# EAGLE design OSSI-1 Battery Board (EAGLE 6.5.0)
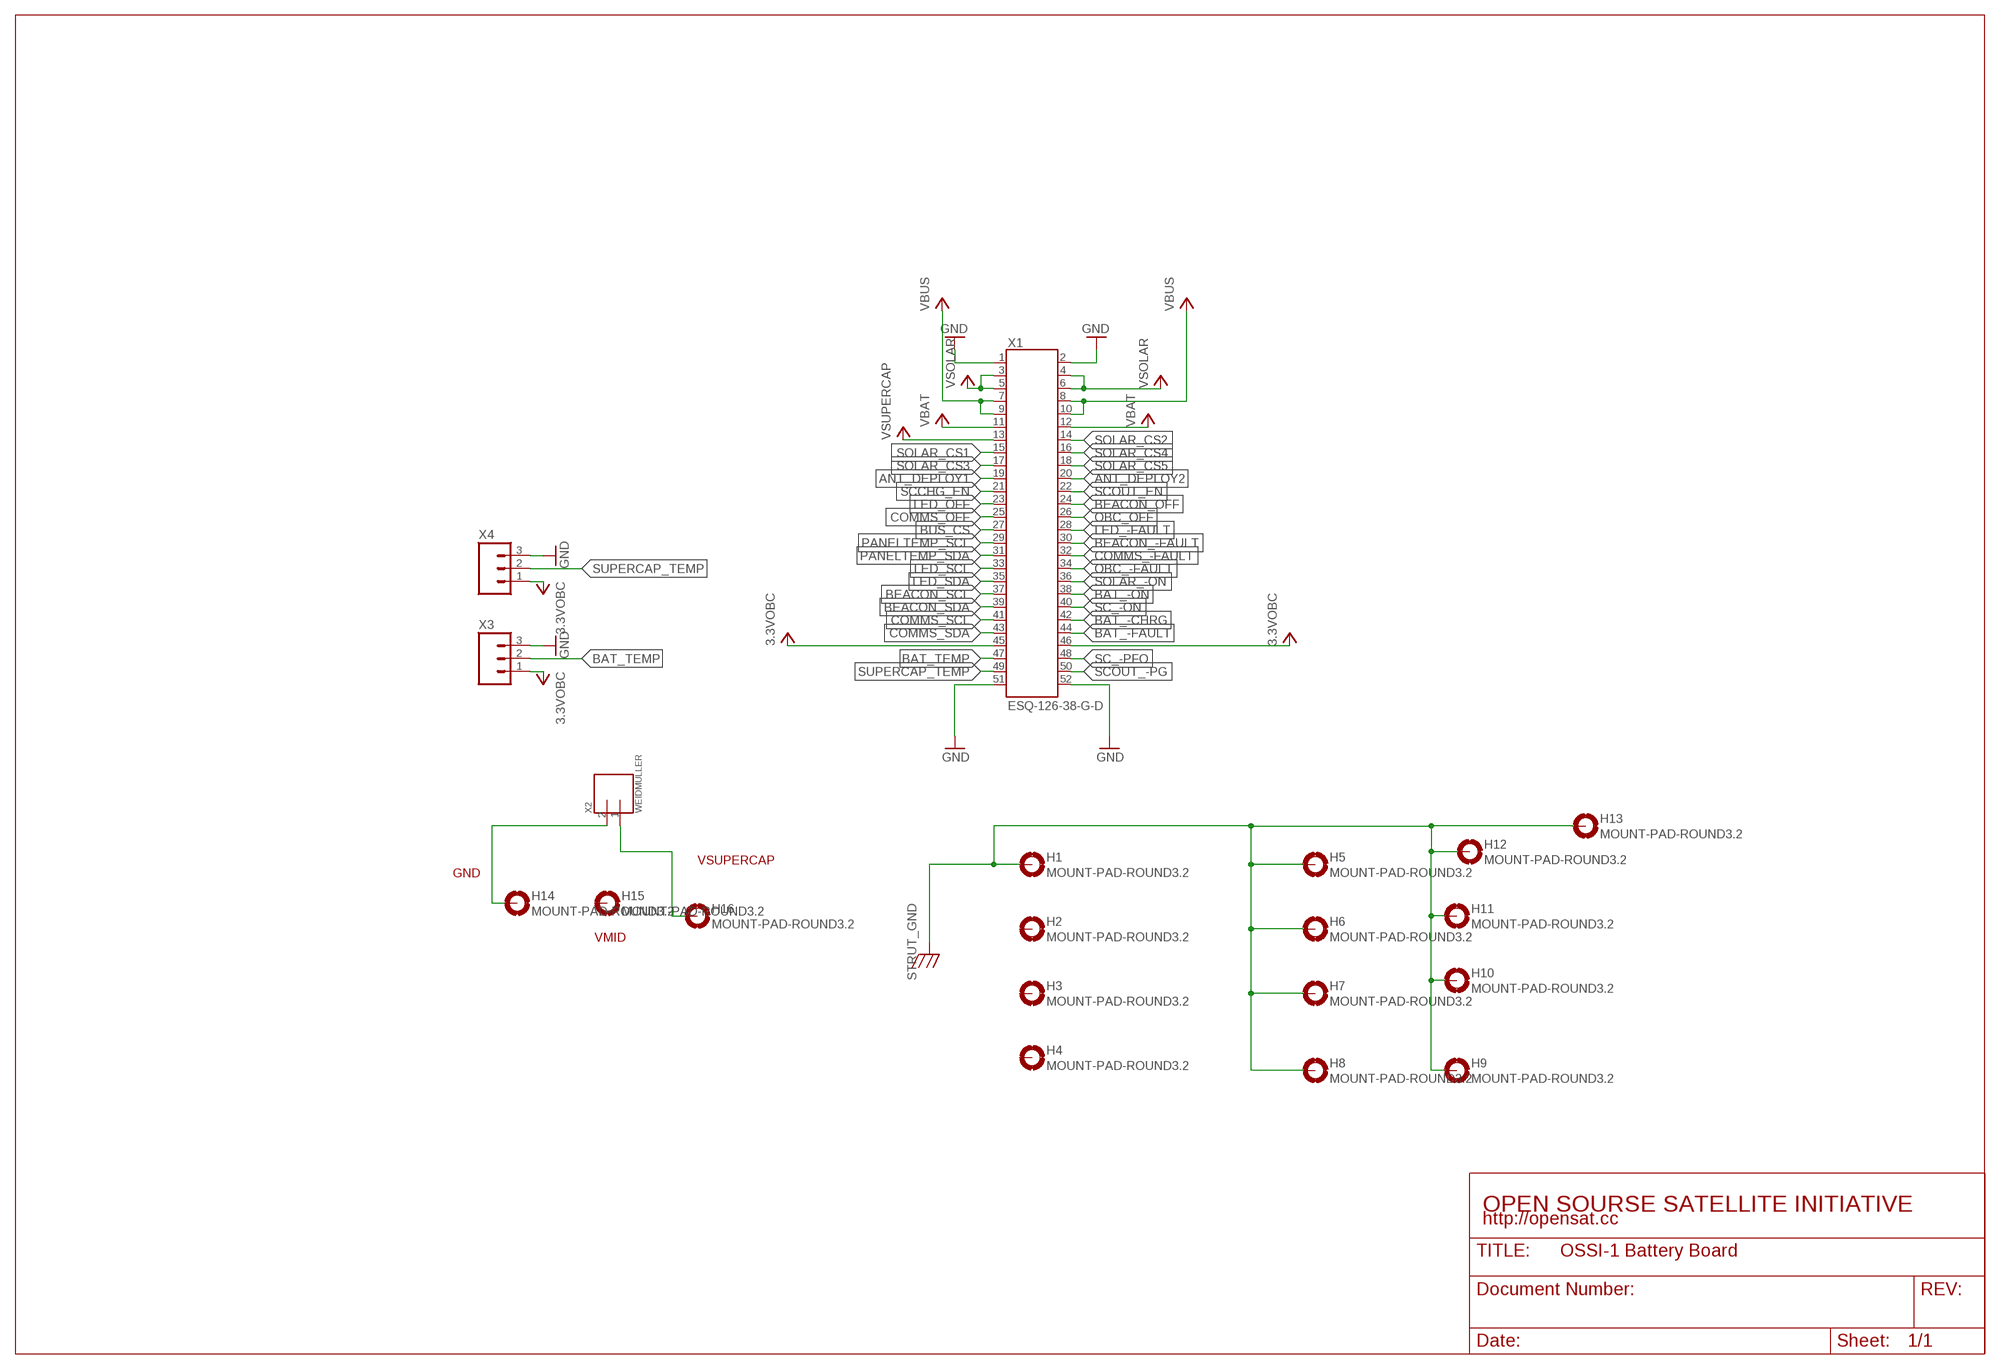
[diagram p0: schematic, sheet 1]

## Parts
H1  MOUNT-PAD-ROUND3.2  [3.2-PAD-ROUND]
H2  MOUNT-PAD-ROUND3.2  [3.2-PAD-ROUND]
H3  MOUNT-PAD-ROUND3.2  [3.2-PAD-ROUND]
H4  MOUNT-PAD-ROUND3.2  [3.2-PAD-ROUND]
H5  MOUNT-PAD-ROUND3.2  [3.2-PAD-ROUND]
H6  MOUNT-PAD-ROUND3.2  [3.2-PAD-ROUND]
H7  MOUNT-PAD-ROUND3.2  [3.2-PAD-ROUND]
H8  MOUNT-PAD-ROUND3.2  [3.2-PAD-ROUND]
H9  MOUNT-PAD-ROUND3.2  [3.2-PAD-ROUND]
H10  MOUNT-PAD-ROUND3.2  [3.2-PAD-ROUND]
H11  MOUNT-PAD-ROUND3.2  [3.2-PAD-ROUND]
H12  MOUNT-PAD-ROUND3.2  [3.2-PAD-ROUND]
H13  MOUNT-PAD-ROUND3.2  [3.2-PAD-ROUND]
H14  MOUNT-PAD-ROUND3.2  [3.2-PAD-ROUND]
H15  MOUNT-PAD-ROUND3.2  [3.2-PAD-ROUND]
H16  MOUNT-PAD-ROUND3.2  [3.2-PAD-ROUND]
X1  ESQ-126-38-G-D  [ESQ-126-XX-X-D]
X2  WEIDMULLER  [WEIDMULLER1760490000]
X3  M03PTH  [1X03]
X4  M03PTH  [1X03]

## Nets
3.3VOBC: X1.45 X1.46 X3.1 X4.1
ANT_DEPLOY1: X1.19
ANT_DEPLOY2: X1.20
BAT_-CHRG: X1.42
BAT_-FAULT: X1.44
BAT_-ON: X1.38
BAT_TEMP: X1.47 X3.2
BEACON_-FAULT: X1.30
BEACON_OFF: X1.24
BEACON_SCL: X1.37
BEACON_SDA: X1.39
BUS_CS: X1.27
COMMS_-FAULT: X1.32
COMMS_OFF: X1.25
COMMS_SCL: X1.41
COMMS_SDA: X1.43
GND: X1.1 X1.2 X1.51 X1.52 X3.3 X4.3
LED_-FAULT: X1.28
LED_OFF: X1.23
LED_SCL: X1.33
LED_SDA: X1.35
N$1: H14.B3,2(MOUNT) X2.2
N$2: H16.B3,2(MOUNT) X2.1
OBC_-FAULT: X1.34
OBC_OFF: X1.26
PANELTEMP_SCL: X1.29
PANELTEMP_SDA: X1.31
SC_-ON: X1.40
SC_-PFO: X1.48
SCCHG_EN: X1.21
SCOUT_-PG: X1.50
SCOUT_EN: X1.22
SOLAR_-ON: X1.36
SOLAR_CS1: X1.15
SOLAR_CS2: X1.14
SOLAR_CS3: X1.17
SOLAR_CS4: X1.16
SOLAR_CS5: X1.18
STRUT_GND: H1.B3,2(MOUNT) H5.B3,2(MOUNT) H6.B3,2(MOUNT) H7.B3,2(MOUNT) H8.B3,2(MOUNT) H9.B3,2(MOUNT) H10.B3,2(MOUNT) H11.B3,2(MOUNT) H12.B3,2(MOUNT) H13.B3,2(MOUNT)
SUPERCAP_TEMP: X1.49 X4.2
VBAT: X1.11 X1.12
VBUS: X1.7 X1.8 X1.9 X1.10
VSOLAR: X1.3 X1.4 X1.5 X1.6
VSUPERCAP: X1.13
Unconnected: H2.B3,2(MOUNT) H3.B3,2(MOUNT) H4.B3,2(MOUNT) H15.B3,2(MOUNT)

## Notes on the sheet
- VSUPERCAP
- GND
- VMID
- OPEN SOURSE SATELLITE INITIATIVE
- http://opensat.cc

## Library data of the parts
H1-H16 = OSSI:MOUNT-PAD-ROUND
X1 = OSSI:ESQ-126-: Samtec ESQ-126-XX-G-D Elevated Sockets Seires ESQ-126-37-G-D ESQ-126-38-G-D ESQ-126-39-G-D
X2 = OSSI:WEIDMULLER
X3 X4 = OSSI:M03: Header 3 Standard 3-pin 0.1" header. Use with straight break away headers (SKU : PRT-00116), right angle break away headers (PRT-00553), swiss pins (PRT-00743), machine pins (PRT-00117), and female headers (PRT-00115). Molex polarized connector foot print use with SKU : PRT-08232 with associated crimp pins and housings.

## Board
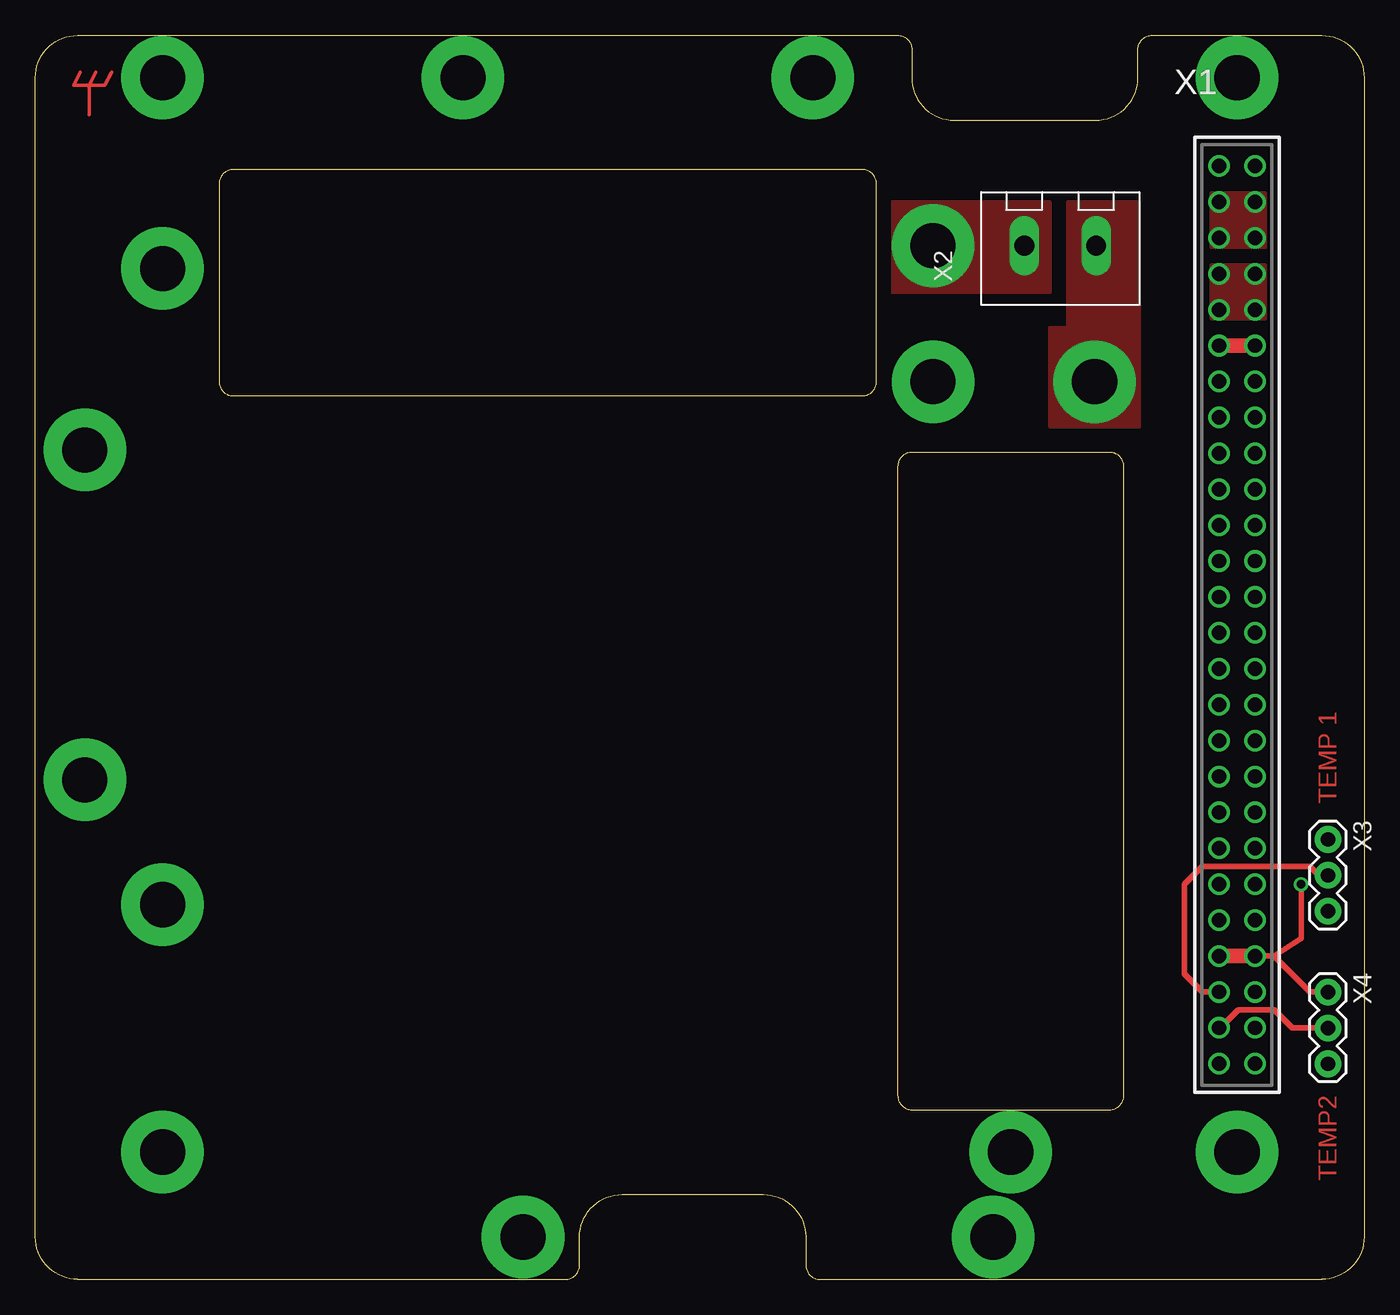
[diagram p1: board, top side]
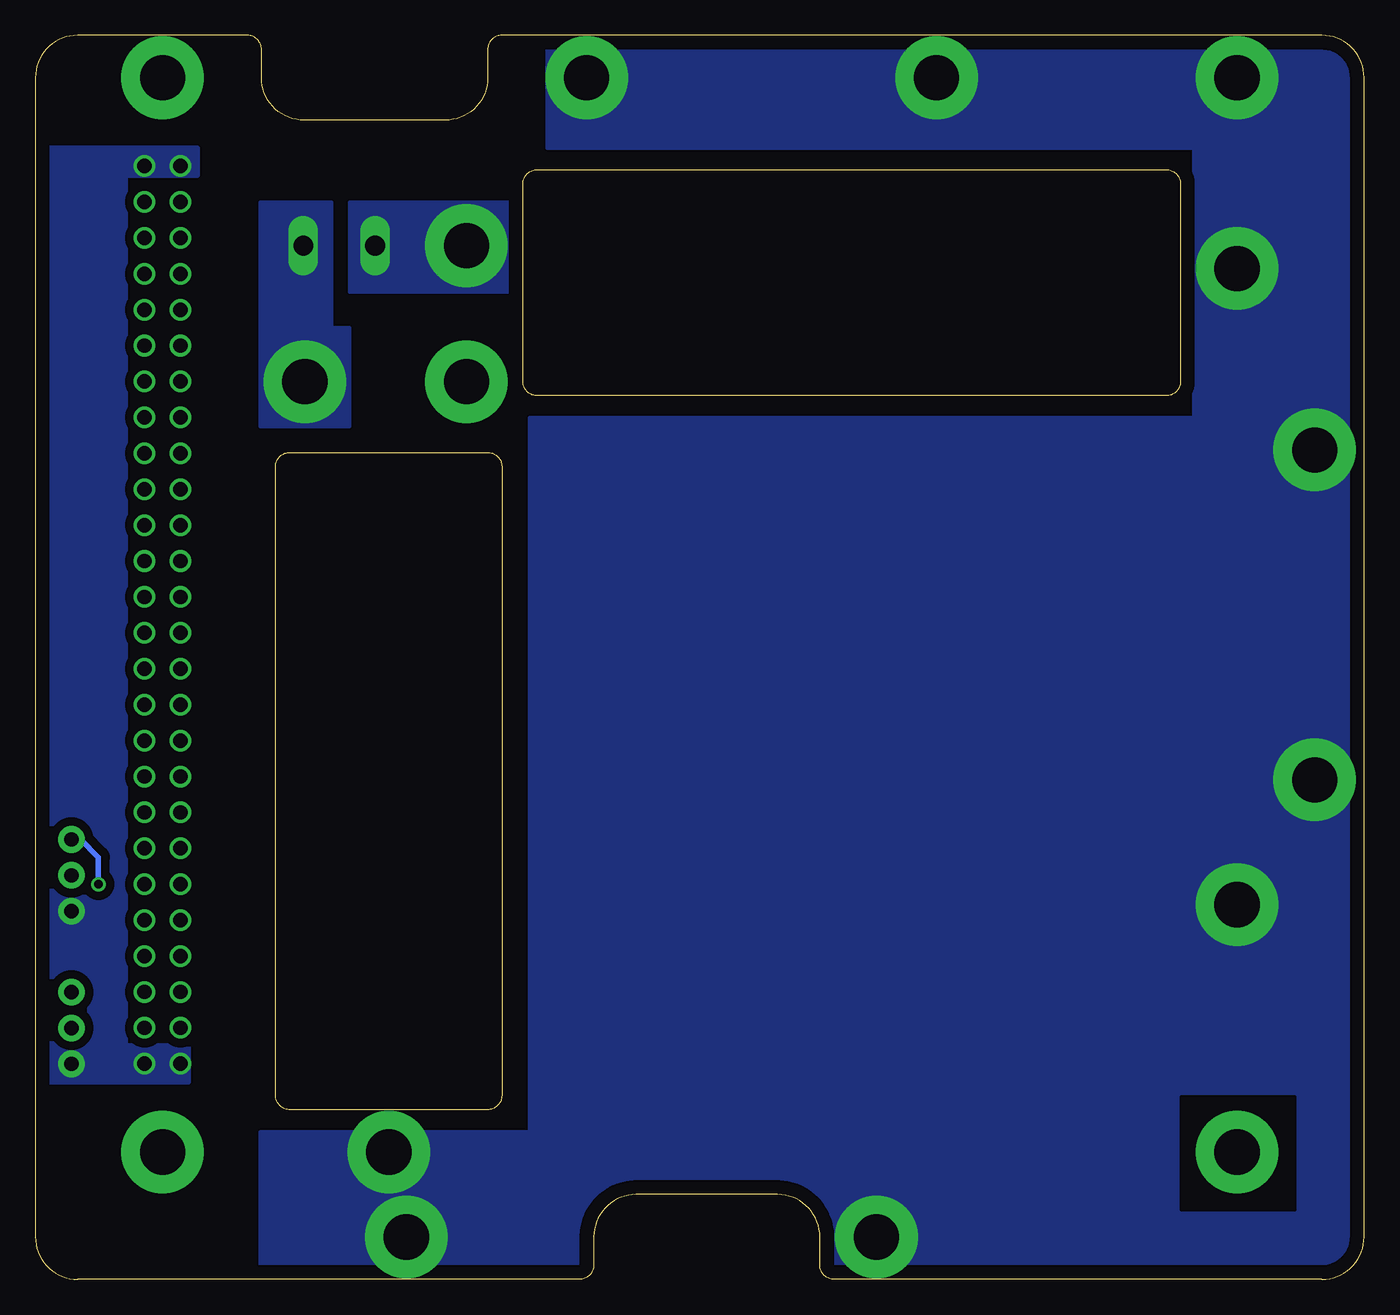
[diagram p2: board, bottom side, seen from below]

Size 94 x 88 mm. Coordinates in mm from the lower left corner, seen from the top.
Outline: 54.5,3 54.5,1 arc90 55.5,0 91,0 arc90 94,3 94,85 arc90 91,88 79,88 arc90 78,87 78,85 arc-90 75,82 65,82 arc-90 62,85 62,87 arc90 61,88 3,88 arc90 0,85 0,3 arc90 3,0 37.5,0 arc90 38.5,1 38.5,3 arc-90 41.5,6 51.5,6 arc-90 54.5,3
Outline: 61,57.5 61,13 arc90 62,12 76,12 arc90 77,13 77,57.5 arc90 76,58.5 62,58.5 arc90 61,57.5
Outline: 14,62.5 58.5,62.5 arc90 59.5,63.5 59.5,77.5 arc90 58.5,78.5 14,78.5 arc90 13,77.5 13,63.5 arc90 14,62.5
Copper layers (1*16): Top 0.035mm / dielectric 1.5mm / Bottom 0.035mm
Design rules "default": minimum track width 10mil, minimum drill 24mil, track to track 8mil, track to pad 8mil, pad to pad 8mil, via to via 8mil, smd to smd 8mil, copper to edge 40mil, drill to drill 8mil, minimum pad ring 10mil, minimum via ring 8mil, stop-mask expansion 4mil, vias tented up to drill 0mil, thermal gap 10mil

### Footprints (pad centres in the part's own frame; a part is rotated, then mirrored left to right if it is on the bottom)
3.2-PAD-ROUND = drill 3.2 pad 5.842: B3,2 0,0
ESQ-126-XX-X-D = drill 1.016 pad 1.524: 1 -1.27,31.75; 2 1.27,31.75; 3 -1.27,29.21; 4 1.27,29.21; 5 -1.27,26.67; 6 1.27,26.67; 7 -1.27,24.13; 8 1.27,24.13; 9 -1.27,21.59; 10 1.27,21.59; 11 -1.27,19.05; 12 1.27,19.05; 13 -1.27,16.51; 14 1.27,16.51; 15 -1.27,13.97; 16 1.27,13.97; 17 -1.27,11.43; 18 1.27,11.43; 19 -1.27,8.89; 20 1.27,8.89; 21 -1.27,6.35; 22 1.27,6.35; 23 -1.27,3.81; 24 1.27,3.81; 25 -1.27,1.27; 26 1.27,1.27; 27 -1.27,-1.27; 28 1.27,-1.27; 29 -1.27,-3.81; 30 1.27,-3.81; 31 -1.27,-6.35; 32 1.27,-6.35; 33 -1.27,-8.89; 34 1.27,-8.89; 35 -1.27,-11.43; 36 1.27,-11.43; 37 -1.27,-13.97; 38 1.27,-13.97; 39 -1.27,-16.51; 40 1.27,-16.51; 41 -1.27,-19.05; 42 1.27,-19.05; 43 -1.27,-21.59; 44 1.27,-21.59; 45 -1.27,-24.13; 46 1.27,-24.13; 47 -1.27,-26.67; 48 1.27,-26.67; 49 -1.27,-29.21; 50 1.27,-29.21; 51 -1.27,-31.75; 52 1.27,-31.75
WEIDMULLER1760490000 = drill 1.4 long: 1 2.54,0; 2 -2.54,0
1X03 = drill 1.016 pad 1.88: 1 0,0; 2 2.54,0; 3 5.08,0

### Placement (x,y rotation side)
H1  9,85 0 top
H2  85,85 0 top
H3  85,9 0 top
H4  9,9 0 top
H5  30.25,85 0 top
H6  55,85 0 top
H7  3.5,58.67 0 top
H8  3.5,35.33 0 top
H9  34.5,3 0 top
H10  67.75,3 0 top
H11  69,9 0 top
H12  9,71.5 0 top
H13  9,26.5 0 top
H14  63.5,73.12 0 top
H15  63.5,63.5 0 top
H16  74.93,63.5 0 top
X1  85,47 0 top
X2  72.5,73.12 0 top
X3  91.44,31.11 270 top
X4  91.44,20.32 270 top

### Tracks (layer width: path | path; a pad name or v marks a point on that pad's centre or on a via)
3.3VOBC  (via drill 0.6)
  Top 0.406: X1.46 87.62,22.87 | 87.62,22.87 90.17,20.32 X4.1 | 87.62,22.87 87.64,22.87 89.53,24.13 v89.53,27.94
  Top 1.016: X1.45 X1.46
  Bottom 0.406: v89.53,27.94 89.53,29.84 90.81,31.11 X3.1
BAT_TEMP
  Top 0.406: X1.47 82.54,20.33 81.28,21.59 81.28,27.94 82.55,29.21 90.17,29.21 90.81,28.57 X3.2
GND
  pour Bottom (isolate 0.61, no thermals): 83.19,16.51 83.19,13.97 93.98,13.97 93.98,80.01 82.55,80.01 82.55,78.11 87.63,78.11 87.63,16.51
N$1
  pour Bottom (no thermals): 60.33,69.85 71.75,69.85 71.75,76.2 60.33,76.2
  pour Top (no thermals): 60.33,69.85 71.75,69.85 71.75,76.2 60.33,76.2
N$2
  pour Bottom (no thermals): 73.03,76.2 73.03,67.31 71.75,67.31 71.75,60.33 78.11,60.33 78.11,76.2
  pour Top (no thermals): 73.03,76.2 73.03,67.31 71.75,67.31 71.75,60.33 78.11,60.33 78.11,76.2
N$56
  cutout Bottom: 4.92,12.92 4.92,4.92 12.92,4.92 12.92,12.92
N$58
  Top 0.254: 3.81,82.39 3.81,84.3
N$59
  Top 0.254: 3.81,84.45 4.92,84.45 5.4,85.41 | 3.81,84.45 2.7,84.45 3.17,85.41 | 3.81,84.45 4.29,85.41
STRUT_GND
  pour Bottom (no thermals): 57.78,87.63 57.78,80.01 12.06,80.01 12.06,60.96 59.05,60.96 59.05,10.43 78.11,10.43 78.11,0 0,0 0,87.63
SUPERCAP_TEMP
  Top 0.406: X1.49 83.83,17.79 85.09,19.05 87.63,19.05 88.9,17.78 X4.2
VBAT
  Top 1.016: X1.11 X1.12
VBUS
  pour Top (no thermals): 83.19,71.75 87,71.75 87,67.94 83.19,67.94
VSOLAR
  pour Top (no thermals): 83.19,76.83 87,76.83 87,73.03 83.19,73.03

### Text on the board
Top: TEMP 1 | TEMP2
tStop: TEMP 1 | TEMP2